# Altium schematic sheet FrontEnd_PS.SchDoc: Title
size 420 x 297 mm; CheckedBy: -; CompanyName: CERN; DrawnBy: DrawnBy; Organization: CERN; Address1: European Organization for Nuclear Research; Address2: CH-1211 Genčve 23 - Switzerland; DocumentNumber: 3; Revision: -; SheetNumber: 3; SheetTotal: 10; EDA_Number: EDA-XXXXX-VX-X; Projet: -; ModifiedBy: -; CreateDate: XX/XX/XXXX; CheckedDate: -; Title2: Title2; DivGrp: TE/MPE; Designer: Designer; ModifiedDate: -
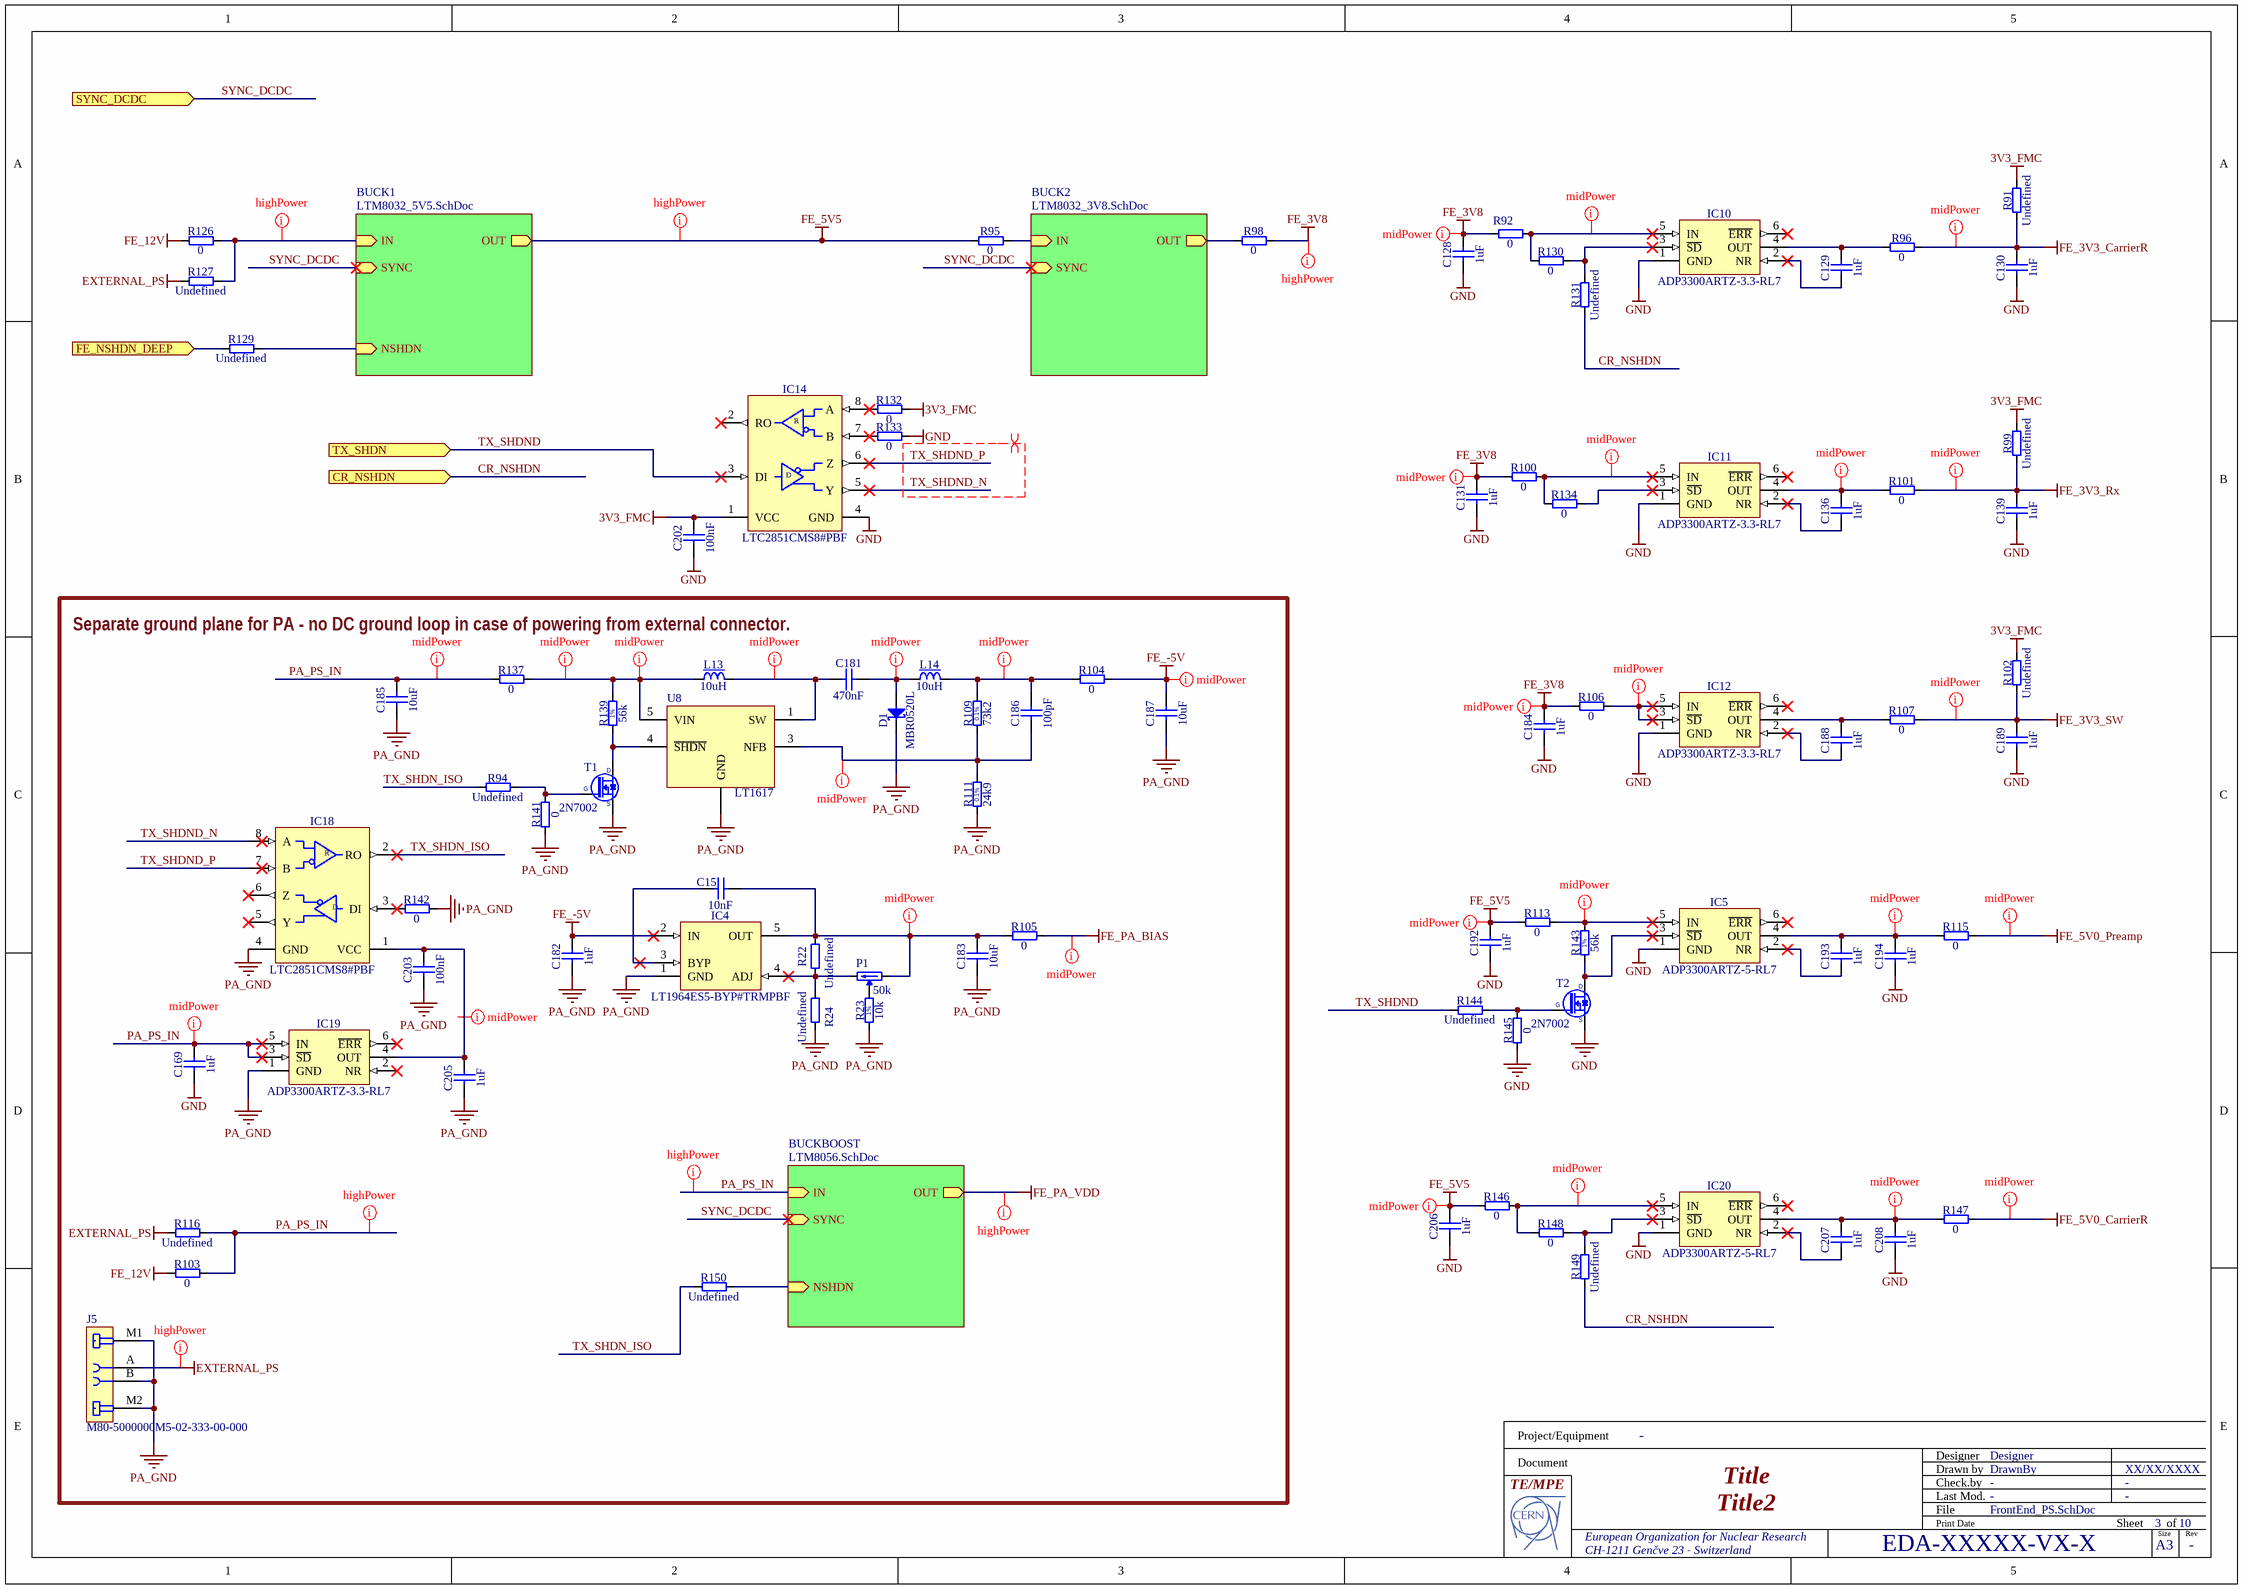
[diagram p0: FrontEnd_PS.SchDoc]

## Parts
C15  10nF  [CAPC1608X87N]
C128  1uF  [CAPC1608X87N]
C129  1uF  [CAPC1608X87N]
C130  1uF  [CAPC1608X87N]
C131  1uF  [CAPC1608X87N]
C136  1uF  [CAPC1608X87N]
C139  1uF  [CAPC1608X87N]
C169  1uF  [CAPC1608X87N]
C181  470nF  [CAPC2012X135N]
C182  1uF  [CAPC1608X87N]
C183  10uF  [CAPC2012X95N]
C184  1uF  [CAPC1608X87N]
C185  10uF  [CAPC2012X95N]
C186  100pF  [CAPC1005X55N]
C187  10uF  [CAPC2012X95N]
C188  1uF  [CAPC1608X87N]
C189  1uF  [CAPC1608X87N]
C192  1uF  [CAPC1608X87N]
C193  1uF  [CAPC1608X87N]
C194  1uF  [CAPC1608X87N]
C202  100nF  [CAPC1005X55N]
C203  100nF  [CAPC1005X55N]
C205  1uF  [CAPC1608X87N]
C206  1uF  [CAPC1608X87N]
C207  1uF  [CAPC1608X87N]
C208  1uF  [CAPC1608X87N]
D1  MBR0520L  [SOD3816X118N]
IC4  LT1964ES5-BYP#TRMPBF  [SOT95P280X100-5N]
IC5  ADP3300ARTZ-5-RL7  [SOT95P280X145-6N]
IC10  ADP3300ARTZ-3.3-RL7  [SOT95P280X145-6N]
IC11  ADP3300ARTZ-3.3-RL7  [SOT95P280X145-6N]
IC12  ADP3300ARTZ-3.3-RL7  [SOT95P280X145-6N]
IC14  LTC2851CMS8#PBF  [SOP65P490X110-8N]
IC18  LTC2851CMS8#PBF  [SOP65P490X110-8N]
IC19  ADP3300ARTZ-3.3-RL7  [SOT95P280X145-6N]
IC20  ADP3300ARTZ-5-RL7  [SOT95P280X145-6N]
J5  M80-5000000M5-02-333-00-000  [M80-5000000M5-02-333-00-000]
L13  10uH  [IND_MURATA_LQH32C]
L14  10uH  [IND_MURATA_LQH32C]
P1  50k  [TRIM_BOURNS_3223W]
R22  Undefined  [RESC1608X55N]
R23  10k  [RESC1005X40N]
R24  Undefined  [RESC1608X55N]
R91  Undefined  [RESC3216X65N]
R92  0  [RESC1608X55N]
R94  Undefined  [RESC1608X55N]
R95  0  [RESC1608X55N]
R96  0  [RESC1608X55N]
R98  0  [RESC1608X55N]
R99  Undefined  [RESC3216X65N]
R100  0  [RESC1608X55N]
R101  0  [RESC1608X55N]
R102  Undefined  [RESC3216X65N]
R103  0  [RESC1608X55N]
R104  0  [RESC1608X55N]
R105  0  [RESC1608X55N]
R106  0  [RESC1608X55N]
R107  0  [RESC1608X55N]
R109  73k2  [RESC1608X55N]
R111  24k9  [RESC1608X55N]
R113  0  [RESC1608X55N]
R115  0  [RESC1608X55N]
R116  Undefined  [RESC3216X65N]
R126  0  [RESC1608X55N]
R127  Undefined  [RESC3216X65N]
R129  Undefined  [RESC1608X55N]
R130  0  [RESC1608X55N]
R131  Undefined  [RESC1608X55N]
R132  0  [RESC1608X55N]
R133  0  [RESC1608X55N]
R134  0  [RESC1608X55N]
R137  0  [RESC1608X55N]
R139  56k  [RESC1005X40N]
R141  0  [RESC1608X55N]
R142  0  [RESC1608X55N]
R143  56k  [RESC1005X40N]
R144  Undefined  [RESC1608X55N]
R145  0  [RESC1608X55N]
R146  0  [RESC1608X55N]
R147  0  [RESC1608X55N]
R148  0  [RESC1608X55N]
R149  Undefined  [RESC1608X55N]
R150  Undefined  [RESC1608X55N]
T1  2N7002  [SOT95P240X130-3N]
T2  2N7002  [SOT95P240X130-3N]
U8  LT1617  [LT1617]

## Sub-sheets
BUCK1 = LTM8032_5V5.SchDoc: IN (in), SYNC (in), OUT (out), NSHDN (in)
BUCK2 = LTM8032_3V8.SchDoc: IN (in), SYNC (in), OUT (out)
BUCKBOOST = LTM8056.SchDoc: IN (in), SYNC (in), OUT (out), NSHDN (in)

## Ports
CR_NSHDN (in), FE_NSHDN_DEEP (in), SYNC_DCDC (in), TX_SHDN (in)

## Nets
3V3_FMC: C202.2 IC14.1(VCC) R91.2 R99.2 R102.2 R132.2
EXTERNAL_PS: J5.A R116.1 R127.1
FE_3V3_CarrierR: C130.2 R91.1 R96.2
FE_3V3_Rx: C139.2 R99.1 R101.2
FE_3V3_SW: C189.2 R102.1 R107.2
FE_3V8: C128.2 C131.2 C184.2 R92.1 R98.2 R100.1 R106.1
FE_5V0_CarrierR: R147.2
FE_5V0_Preamp: R115.2
FE_5V5: C192.2 C206.2 R95.1 R113.1 R146.1 ; sheet BUCK1/OUT
FE_12V: R103.1 R126.1
FE_-5V: C182.2 C187.2 IC4.2(IN) R104.2
FE_PA_BIAS: R105.2
FE_PA_VDD: sheet BUCKBOOST/OUT
GND: C128.1 C130.1 C131.1 C139.1 C169.1 C184.1 C189.1 C192.1 C194.1 C202.1 C206.1 C208.1 IC5.1(GND) IC10.1(GND) IC11.1(GND) IC12.1(GND) IC14.4(GND) IC20.1(GND) R133.2 R145.1 T2.2(S)
PA_GND: C182.1 C183.1 C185.1 C187.1 C203.1 C205.1 D1.1(C) IC4.1(GND) IC18.4(GND) IC19.1(GND) J5.B J5.M1 J5.M2 R23.1 R24.1 R111.1 R141.1 R142.2 T1.2(S) U8.2(GND)
CR_NSHDN: R131.1 R149.1 ; port CR_NSHDN
FE_NSHDN_DEEP: R129.1 ; port FE_NSHDN_DEEP
PA_PS_IN: C169.2 C185.2 IC19.3(~{SD}) IC19.5(IN) R103.2 R116.2 R137.1 ; sheet BUCKBOOST/IN
SYNC_DCDC: port SYNC_DCDC, sheet BUCK1/SYNC, sheet BUCK2/SYNC, sheet BUCKBOOST/SYNC
TX_SHDN_ISO: IC18.2(RO) R94.1 R150.1
TX_SHDND: IC14.3(DI) R144.1 ; port TX_SHDN
TX_SHDND_N: IC14.5(Y) IC18.8(A)
TX_SHDND_P: IC14.6(Z) IC18.7(B)
NetC15_1: C15.1 IC4.3(BYP)
NetC15_2: C15.2 C183.2 IC4.5(OUT) P1.1(CCW) R22.2 R105.1
NetC129_1: C129.1 IC10.2(NR)
NetC129_2: C129.2 IC10.4(OUT) R96.1
NetC136_1: C136.1 IC11.2(NR)
NetC136_2: C136.2 IC11.4(OUT) R101.1
NetC181_1: C181.1 L13.2 U8.1(SW)
NetC181_2: C181.2 D1.2(A) L14.1
NetC186_1: C186.1 R109.1 R111.2 U8.3(NFB)
NetC186_2: C186.2 L14.2 R104.1 R109.2
NetC188_1: C188.1 IC12.2(NR)
NetC188_2: C188.2 IC12.4(OUT) R107.1
NetC193_1: C193.1 IC5.2(NR)
NetC193_2: C193.2 C194.2 IC5.4(OUT) R115.1
NetC203_2: C203.2 C205.2 IC18.1(VCC) IC19.4(OUT)
NetC207_1: C207.1 IC20.2(NR)
NetC207_2: C207.2 C208.2 IC20.4(OUT) R147.1
NetIC4_4: IC4.4(ADJ) P1.3(CW) R22.1 R24.2
NetIC5_3: IC5.3(~{SD}) R143.1 T2.3(D)
NetIC5_5: IC5.5(IN) R113.2 R143.2
NetIC10_3: IC10.3(~{SD}) R130.2 R131.2
NetIC10_5: IC10.5(IN) R92.2 R130.1
NetIC11_3: IC11.3(~{SD}) R134.2
NetIC11_5: IC11.5(IN) R100.2 R134.1
NetIC12_3: IC12.3(~{SD}) IC12.5(IN) R106.2
NetIC14_7: IC14.7(B) R133.1
NetIC14_8: IC14.8(A) R132.1
NetIC18_3: IC18.3(DI) R142.1
NetIC20_3: IC20.3(~{SD}) R148.2 R149.2
NetIC20_5: IC20.5(IN) R146.2 R148.1
NetL13_1: L13.1 R137.2 R139.2 U8.5(VIN)
NetP1_2: P1.2(W) R23.2
NetR94_2: R94.2 R141.2 T1.1(G)
NetR95_2: R95.2 ; sheet BUCK2/IN
NetR98_1: R98.1 ; sheet BUCK2/OUT
NetR126_2: R126.2 R127.2 ; sheet BUCK1/IN
NetR129_2: R129.2 ; sheet BUCK1/NSHDN
NetR139_1: R139.1 T1.3(D) U8.4(~{SHDN})
NetR144_2: R144.2 R145.2 T2.1(G)
NetR150_2: R150.2 ; sheet BUCKBOOST/NSHDN

Not connected (* = marked no-connect by the designer): IC5 6(~{ERR})*; IC10 6(~{ERR})*; IC11 6(~{ERR})*; IC12 6(~{ERR})*; IC14 2(RO)*; IC18 5(Y)* 6(Z)*; IC19 2(NR)* 6(~{ERR})*; IC20 6(~{ERR})*

## Layout directives
net class midPower: (no net found under the mark), FE_3V3_CarrierR, FE_3V3_Rx, FE_3V3_SW, FE_3V8, FE_5V0_CarrierR, FE_5V0_Preamp, FE_5V5, FE_-5V, FE_PA_BIAS, NetC15_2, NetC136_2, NetC181_1, NetC181_2, NetC186_1, NetC186_2, NetC193_2, NetC207_2, NetIC5_5, NetIC10_5, NetIC11_5, NetIC12_3, NetIC20_5, NetL13_1, PA_PS_IN
net class highPower: EXTERNAL_PS, FE_3V8, FE_5V5, FE_PA_VDD, NetR126_2, PA_PS_IN
differential pair; differential pair class 100R_diff: TX_SHDND_N, TX_SHDND_P

## Notes on the sheet
- Separate ground plane for PA - no DC ground loop in case of powering from external connector.
- (near R105) Starting from -4.5V
- Now 24V. Can be 5V.
- Project/Equipment
- Document
- Designer
- Drawn by
- Check.by
- File
- Last Mod.
- Print Date
- Sheet
- Size
- A3
- of
- Rev
- (in symbol LTC2851CMS8#PBF) R; D
- (in symbol R0402_10K_1%_0.0625W_100PPM) 1%
- (in symbol R0402_56K_1%_0.0625W_100PPM) 1%
- (in symbol R0603_24K9_0.1%_0.063W_10PPM) 0.1%
- (in symbol R0603_73K2_0.1%_0.063W_10PPM) 0.1%

## Library data of the parts
C15 = CC0603_10NF_50V_5%_C0G: Non-polarised capacitor; Part Description: SMD Multilayer Chip Ceramic Capacitor; Manufacturer: GENERIC; Manufacturer1 Part Number: C1608C0G1H103J080AA; Voltage: 50V; TC: C0G/NP0; Tolerance: ±5%; Part Number: CC0603_10NF_50V_5%_C0G; Component Kind: Standard; Component Type: Standard; Pin Count: 2; Value: 10nF; Status: Preferred; Manufacturer Part Number: CC0603_10NF_50V_5%_C0G; Case: 0603; Mounted: Yes; Socket: No; SMD: Yes; Sense: No; Manufacturer1 Example: TDK; Manufacturer1 ComponentHeight: 0.9mm; HelpURL: \\cern.ch\dfs\Applications\Altium\Datasheets\CC0603_C0G_TDK_C.pdf; Author: CERN DEM JLC; CreateDate: 10.12.2014; LatestRevisionDate: 10.12.2014
C128-C131 C136 C139 C169 C182 C184 C188 C189 C192-C194 C205-C208 = CC0603_1UF_25V_10%_X7R: Non-polarised capacitor; Part Description: SMD Multilayer Chip Ceramic Capacitor; Manufacturer: GENERIC; Manufacturer1 Part Number: GRM188R71E105KA12D; Voltage: 25V; TC: X7R; Tolerance: ±10%; Part Number: CC0603_1UF_25V_10%_X7R; Component Kind: Standard; Component Type: Standard; Pin Count: 2; Value: 1uF; Status: None; Manufacturer Part Number: CC0603_1UF_25V_10%_X7R; Case: 0603; Mounted: Yes; Socket: No; SMD: Yes; Sense: No; Manufacturer1 Example: MURATA; Manufacturer1 ComponentHeight: 0.9mm; HelpURL: \\cern.ch\dfs\Applications\Altium\Datasheets\CC0603_X7R_MURATA.pdf; Author: CERN DEM JLC; CreateDate: 18/01/2011; LatestRevisionDate: 18/01/2011
C181 = CC0805_470NF_16V_10%_X7R: Non-polarised capacitor; Part Description: SMD Multilayer Chip Ceramic Capacitor; Manufacturer: GENERIC; Manufacturer1 Part Number: CC0805KKX7R7BB474; Voltage: 16V; TC: X7R; Tolerance: ±10%; Part Number: CC0805_470NF_16V_10%_X7R; Component Kind: Standard; Component Type: Standard; Pin Count: 2; Value: 470nF; Status: Preferred; Manufacturer Part Number: CC0805_470NF_16V_10%_X7R; Case: 0805; Mounted: Yes; Socket: No; SMD: Yes; Sense: No; Manufacturer1 Example: YAGEO; Manufacturer1 ComponentHeight: 1.45mm; HelpURL: \\cern.ch\dfs\Applications\Altium\Datasheets\CC0805_X7R_YAGEO_HIGH CAPACITANCE_MAX50V.pdf; Author: CERN DEM JLC; CreateDate: 03.12.2007; LatestRevisionDate: 21.04.2015
C183 C185 C187 = CC0805_10UF_25V_10%_X5R: Non-polarised capacitor; Part Description: SMD Multilayer Chip Ceramic Capacitor; Manufacturer: GENERIC; Manufacturer1 Part Number: GRM219R61E106KA12D; Voltage: 25V; TC: X5R; Tolerance: ±10%; Part Number: CC0805_10UF_25V_10%_X5R; Component Kind: Standard; Component Type: Standard; Pin Count: 2; Value: 10uF; Status: Preferred; Manufacturer Part Number: CC0805_10UF_25V_10%_X5R; Case: 0805; Mounted: Yes; Socket: No; SMD: Yes; Sense: No; Manufacturer1 Example: MURATA; Manufacturer1 ComponentHeight: 0.95mm; HelpURL: \\cern.ch\dfs\Applications\Altium\Datasheets\CC0805_X5R_MURATA_GRM.pdf; Author: CERN DEM JLC; CreateDate: 25/10/2012; LatestRevisionDate: 06/09/2016
C186 = CC0402_100PF_50V_5%_C0G: Non-polarised capacitor; Part Description: SMD Multilayer Chip Ceramic Capacitor; Manufacturer: GENERIC; Manufacturer1 Part Number: C0402C101J5GACTU; Voltage: 50V; TC: C0G/NP0; Tolerance: ±5%; Part Number: CC0402_100PF_50V_5%_C0G; Component Kind: Standard; Component Type: Standard; Pin Count: 2; Value: 100pF; Status: Preferred; Manufacturer Part Number: CC0402_100PF_50V_5%_C0G; Case: 0402; Mounted: Yes; Socket: No; SMD: Yes; Sense: No; Manufacturer1 Example: KEMET; Manufacturer1 ComponentHeight: 0.55mm; HelpURL: \\cern.ch\dfs\Applications\Altium\Datasheets\CC0805_C0G_KEMET_(Commercial Grade).pdf; Author: CERN DEM JLC; CreateDate: 03.12.2007; LatestRevisionDate: 22.04.2015
C202 C203 = CC0402_100NF_16V_10%_X7R: Non-polarised capacitor; Part Description: SMD Multilayer Chip Ceramic Capacitor; Manufacturer: GENERIC; Manufacturer1 Part Number: GRM155R71C104KA88D; Voltage: 16V; TC: X7R; Tolerance: ±10%; Part Number: CC0402_100NF_16V_10%_X7R; Component Kind: Standard; Component Type: Standard; Pin Count: 2; Value: 100nF; Status: Not Recommended; Manufacturer Part Number: CC0402_100NF_16V_10%_X7R; Case: 0402; Mounted: Yes; Socket: No; SMD: Yes; Sense: No; Manufacturer1 Example: MURATA; Manufacturer1 ComponentHeight: 0.55mm; HelpURL: \\cern.ch\dfs\Applications\Altium\Datasheets\CC0402_X7R_MURATA_GRM.pdf; Author: CERN DEM JLC; CreateDate: 05.12.2013; LatestRevisionDate: 03.12.2007
D1 = MBR0520L: Schottky Diode; Part Description: Schottky Power Rectifier; Manufacturer: FAIRCHILD SEMICONDUCTOR; Voltage: 20V; Power: 0.5A; PressFit: No; Bonding: No; Part Number: MBR0520L; Component Kind: Standard; Component Type: Standard; Device: MBR0520L; PackageDescription: SOD Diode (SOD-123); 2.70mm W X 1.60mm L X 1.18mm H body, IPC Medium Density; Manufacturer Part Number: MBR0520L; Pin Count: 2; Case: SOD-123; Mounted: Yes; Socket: No; SMD: Yes; Sense: No; ComponentHeight: 1.18mm; HelpURL: \\cern.ch\dfs\Applications\Altium\Datasheets\MBR0520L.pdf; Author: CERN DEM JLC; CreateDate: 25.11.2009; LatestRevisionDate: 25.11.2009
IC4 = LT1964ES5-BYP#TRMPBF: 200mA, Low Noise, Low Dropout Negative Micropower Regulator; Part Description: -1.22V to -20V, 200mA, Low Noise, Low Dropout Negative Micropower Regulator; Manufacturer: LINEAR TECHNOLOGY; PressFit: No; Bonding: No; Part Number: LT1964ES5-BYP#TRMPBF; Component Kind: Standard; Component Type: Standard; Device: LT1964ES5-BYP#TRMPBF; PackageDescription: SOT23, 0.95mm pitch; 5 pin, 1.75mm W X 3.00mm L, IPC Medium Density; Manufacturer Part Number: LT1964ES5-BYP#TRMPBF; Pin Count: 5; Case: SOT23-5; Mounted: Yes; Socket: No; SMD: Yes; Sense: No; ComponentHeight: 1mm; HelpURL: \\cern.ch\dfs\Applications\Altium\Datasheets\LT1964ES5-BYP#TRMPBF.pdf; Author: CERN DEM MR; CreateDate: 17.02.2016; LatestRevisionDate: 17.02.2016
IC5 IC20 = ADP3300ARTZ-5-RL7: High Accuracy anyCAP® 50 mA Low Dropout Linear Regulator; Part Description: 5V High Accuracy anyCAP® 50 Ma Low Dropout Linear Regulator; Manufacturer: ANALOG DEVICES; PressFit: No; Bonding: No; Part Number: ADP3300ARTZ-5-RL7; Component Kind: Standard; Component Type: Standard; Device: ADP3300ARTZ-5-RL7; PackageDescription: SOT23, 0.95mm pitch; 6 pin, 1.6mm W X 2.9mm L X 1.45mm H body, IPC Medium Density; Manufacturer Part Number: ADP3300ARTZ-5-RL7; Pin Count: 6; Case: SOT23-6; Mounted: Yes; Socket: No; SMD: Yes; Sense: No; ComponentHeight: 1.45mm; HelpURL: \\cern.ch\dfs\Applications\Altium\Datasheets\ADP3300ARTZ-5-RL7.pdf; Author: CERN DEM JLC; CreateDate: 30.11.2011; LatestRevisionDate: 30.11.2011
IC10-IC12 IC19 = ADP3300ARTZ-3.3-RL7: High Accuracy anyCAP® 50 mA Low Dropout Linear Regulator; Part Description: 3.3V High Accuracy anyCAP® 50 Ma Low Dropout Linear Regulator; Manufacturer: ANALOG DEVICES; PressFit: No; Bonding: No; Part Number: ADP3300ARTZ-3.3-RL7; Component Kind: Standard; Component Type: Standard; Device: ADP3300ARTZ-3.3-RL7; PackageDescription: SOT23, 0.95mm pitch; 6 pin, 1.6mm W X 2.9mm L X 1.45mm H body, IPC Medium Density; Manufacturer Part Number: ADP3300ARTZ-3.3-RL7; Pin Count: 6; Case: SOT23-6; Mounted: Yes; Socket: No; SMD: Yes; Sense: No; ComponentHeight: 1.45mm; HelpURL: \\cern.ch\dfs\Applications\Altium\Datasheets\ADP3300ARTZ-3.3-RL7.pdf; Author: CERN DEM JLC; CreateDate: 30.11.2011; LatestRevisionDate: 30.11.2011
IC14 IC18 = LTC2851CMS8#PBF: 3.3V 20Mbps RS485/RS422 Transceivers; Manufacturer: LINEAR TECHNOLOGY; PressFit: No; Bonding: No; Part Number: LTC2851CMS8#PBF; Component Kind: Standard; Component Type: Standard; Device: LTC2851CMS8#PBF; PackageDescription: SOP, 0.65mm pitch; 8 pin, 3.00mm W X 3.00mm L X 1.10mm H body, IPC Medium Density; Part Description: 3.3V 20Mbps RS485/RS422 Transceivers; Manufacturer Part Number: LTC2851CMS8#PBF; Pin Count: 8; Case: MSOP8; Mounted: Yes; Socket: No; SMD: Yes; Sense: No; ComponentHeight: 1.1mm; HelpURL: \\cern.ch\dfs\Applications\Altium\Datasheets\LTC2851CMS8#PBF.pdf; Author: CERN DEM JLC; CreateDate: 14.12.2010; LatestRevisionDate: 14.12.2010
J5 = CON_M80-5000000M5-02-333-00-000: 2pin (2 power), THT socket with M2 jackscrews; Manufacturer: Harwin; Part Number: M80-5L10405M5-02-333-00-000; Bonding: No; ComponentHeigth: 6.05mm; PressFit: No; Case: M80-5000000M5-02-333-00-000; Component Kind: Standard; Component Type: Standard; CreateDate: 2018-06-18; Device: M80-5000000M5-02-333-00-000; HelpURL: https://www.harwin.com/products/M80-5000000M5-02-333-00-000/; LatestRevisionDate: 2018-06-18; Manufacturer Part Number: M80-5000000M5-02-333-00-000; Mounted: Yes; PackageDescription: H=6.05mm, W=18mm, D=8.6mm; Part Description: 2pin (2 power), THT socket with M2 jackscrews; Pin Count: 6; Sense: No; SMD: No; Socket: No; Value: *
L13 L14 = IND_10UH_10%_MURATA_LQH32CN100K33L: Inductor With Core; Part Description: Chip Inductor (Chip Coil) for Choke Wire Wound Type; Manufacturer: MURATA; Power: 450mA; Resistance: 0.3R; Tolerance: ±10%; Part Number: IND_10UH_10%_MURATA_LQH32CN100K33L; Component Kind: Standard; Component Type: Standard; Pin Count: 2; Value: 10uH; Status: None; Manufacturer Part Number: LQH32CN100K33L; Mounted: Yes; Socket: No; SMD: Yes; Sense: No; ComponentHeight: 2.2mm; HelpURL: \\cern.ch\dfs\Applications\Altium\Datasheets\IND_MURATA_LQH32CN_33.pdf; Author: CERN DEM JLC; CreateDate: 06.04.2009; LatestRevisionDate: 04.07.2018
P1 = TRIM_11T_50K_BOURNS_3223W-1-503E: Trimming Potentiometer; Part Description: 11 Turns SMD Trimpot® Trimming Potentiometer (Top Adjust); Manufacturer: BOURNS; Power: 0.125W; TC: ±100ppm/°C; Tolerance: ±20%; PressFit: No; Part Number: TRIM_11T_50K_BOURNS_3223W-1-503E; Component Kind: Standard; Component Type: Standard; Pin Count: 3; Value: 50k; Manufacturer Part Number: 3223W-1-503E; Case: 3223W; Mounted: Yes; Socket: No; SMD: Yes; Sense: No; ComponentHeight: 4.16mm; HelpURL: \\cern.ch\dfs\Applications\Altium\Datasheets\TRIM_BOURNS_3223W.pdf; Author: CERN DEM JLC; CreateDate: 31.03.2011; LatestRevisionDate: 18.12.2012
R22 R24 R94 R129 R131 R144 R149 R150 = R0603_NO-VALUE: Resistor; Part Description: Reserved Footprint For a 0603 (1608) Chip Resistor; PressFit: No; Mounted: No; Part Number: R0603_NO-VALUE; Component Kind: Standard; Component Type: Standard; Pin Count: 2; Value: Undefined; Status: None; Manufacturer: Undefined; Manufacturer Part Number: R0603_NO-VALUE; Case: 0603; Sense: No; Socket: No; SMD: Yes; Manufacturer1 Example: Undefined; Manufacturer1 Part Number: Undefined; Manufacturer1 ComponentHeight: Undefined; HelpURL: Undefined; Author: CERN DEM JLC; CreateDate: 03.12.2007; LatestRevisionDate: 13.03.2008
R23 = R0402_10K_1%_0.0625W_100PPM: Resistor - 1%; Part Description: General Purpose Thick Film Chip Resistor; Manufacturer: GENERIC; Manufacturer1 Part Number: 232270671003L; TC: ±100ppm/°C; PressFit: No; Part Number: R0402_10K_1%_0.0625W_100PPM; Component Kind: Standard; Component Type: Standard; Pin Count: 2; Value: 10k; Status: Not Recommended; Power: 0.0625W; Tolerance: ±1%; Manufacturer Part Number: R0402_10K_1%_0.0625W_100PPM; Case: 0402; Mounted: Yes; Sense: No; Socket: No; SMD: Yes; Manufacturer1 Example: YAGEO PHYCOMP; Manufacturer1 ComponentHeight: 0.4mm; HelpURL: \\cern.ch\dfs\Applications\Altium\Datasheets\R0402_Phycomp_RC0402.pdf; Author: CERN DEM JLC; CreateDate: 03.12.2007; LatestRevisionDate: 17.10.2012
R91 R99 R102 R116 R127 = R1206_NO-VALUE: Resistor; Part Description: Reserved Footprint For a 1206 (3216) Chip Resistor; PressFit: No; Mounted: No; Part Number: R1206_NO-VALUE; Component Kind: Standard; Component Type: Standard; Pin Count: 2; Value: Undefined; Status: None; Manufacturer: Undefined; Manufacturer Part Number: R1206_NO-VALUE; Case: 1206; Sense: No; Socket: No; SMD: Yes; Manufacturer1 Example: Undefined; Manufacturer1 Part Number: Undefined; Manufacturer1 ComponentHeight: 0.65mm; HelpURL: Undefined; Author: CERN DEM JLC; CreateDate: 03.12.2007; LatestRevisionDate: 13.03.2008
R92 R95 R96 R98 R100 R101 R103-R107 R113 R115 R126 R130 R132-R134 R137 R141 R142 R145-R148 = R0603_0R_JUMPER: Resistor; Part Description: 1A (0.05R Max DC Resistance) Zero Ohm Jumper; Manufacturer: GENERIC; Manufacturer1 Part Number: NRC06Z0; PressFit: No; Part Number: R0603_0R_JUMPER; Component Kind: Standard; Component Type: Standard; Pin Count: 2; Value: 0; Status: Preferred; Manufacturer Part Number: R0603_0R_JUMPER; Case: 0603; Mounted: Yes; Sense: No; Socket: No; SMD: Yes; Manufacturer1 Example: NIC COMPONENT; Manufacturer1 ComponentHeight: 0.55mm; HelpURL: \\cern.ch\dfs\Applications\Altium\Datasheets\R0603_NIC_NRC.pdf; Author: CERN DEM JLC; CreateDate: 03.12.2007; LatestRevisionDate: 13.03.2008
R109 = R0603_73K2_0.1%_0.063W_10PPM: Resistor - 0.1%; Part Description: Thin Film Chip Resistor; Manufacturer: GENERIC; Manufacturer1 Part Number: RN73C1J73K2BTDF; Power: 0.063W; TC: ±10ppm; PressFit: No; Part Number: R0603_73K2_0.1%_0.063W_10PPM; Component Kind: Standard; Component Type: Standard; Pin Count: 2; Value: 73k2; Status: Not Recommended; Tolerance: ±0.1%; Manufacturer Part Number: R0603_73K2_0.1%_0.063W_10PPM; Case: 0603; Mounted: Yes; Sense: No; Socket: No; SMD: Yes; Manufacturer1 Example: TYCO HOLSWORTHY; Manufacturer1 ComponentHeight: 0.5mm; HelpURL: \\cern.ch\dfs\Applications\Altium\Datasheets\R0603_Tyco_RN73.pdf; Author: CERN DEM JLC; CreateDate: 03.12.2007; LatestRevisionDate: 13.03.2008
R111 = R0603_24K9_0.1%_0.063W_10PPM: Resistor - 0.1%; Part Description: Thin Film Chip Resistor; Manufacturer: GENERIC; Manufacturer1 Part Number: RN73C1J24K9BTDF; Power: 0.063W; TC: ±10ppm; PressFit: No; Part Number: R0603_24K9_0.1%_0.063W_10PPM; Component Kind: Standard; Component Type: Standard; Pin Count: 2; Value: 24k9; Status: Not Recommended; Tolerance: ±0.1%; Manufacturer Part Number: R0603_24K9_0.1%_0.063W_10PPM; Case: 0603; Mounted: Yes; Sense: No; Socket: No; SMD: Yes; Manufacturer1 Example: TYCO HOLSWORTHY; Manufacturer1 ComponentHeight: 0.5mm; HelpURL: \\cern.ch\dfs\Applications\Altium\Datasheets\R0603_Tyco_RN73.pdf; Author: CERN DEM JLC; CreateDate: 03.12.2007; LatestRevisionDate: 13.03.2008
R139 R143 = R0402_56K_1%_0.0625W_100PPM: Resistor - 1%; Part Description: General Purpose Thick Film Chip Resistor; Manufacturer: GENERIC; Manufacturer1 Part Number: 232270675603L; TC: ±100ppm/°C; PressFit: No; Part Number: R0402_56K_1%_0.0625W_100PPM; Component Kind: Standard; Component Type: Standard; Pin Count: 2; Value: 56k; Status: Not Recommended; Power: 0.0625W; Tolerance: ±1%; Manufacturer Part Number: R0402_56K_1%_0.0625W_100PPM; Case: 0402; Mounted: Yes; Sense: No; Socket: No; SMD: Yes; Manufacturer1 Example: YAGEO PHYCOMP; Manufacturer1 ComponentHeight: 0.4mm; HelpURL: \\cern.ch\dfs\Applications\Altium\Datasheets\R0402_Phycomp_RC0402.pdf; Author: CERN DEM JLC; CreateDate: 03.12.2007; LatestRevisionDate: 17.10.2012
T1 T2 = 2N7002: N-CHANNEL MOSFET WITH DIODE; Part Description: 60V 280mA N-Channel Enhancement Mode Field Effect Transistor (FET); Manufacturer: FAIRCHILD SEMICONDUCTOR; PressFit: No; Bonding: No; Part Number: 2N7002; Component Kind: Standard; Component Type: Standard; Device: 2N7002; PackageDescription: SOT23 3-Leads, Pitch 0.95mm - Body 1.3x2.9mm, IPC Medium Density; Manufacturer Part Number: 2N7002; Pin Count: 3; Case: SOT23-3; Mounted: Yes; Socket: No; SMD: Yes; Sense: No; ComponentHeight: 1.3mm; HelpURL: \\cern.ch\dfs\Applications\Altium\Datasheets\2N7002.pdf; Author: CERN DEM JLC; CreateDate: 20.08.2008; LatestRevisionDate: 07.04.2009